# Altium schematic sheet Test.SchDoc
size A4
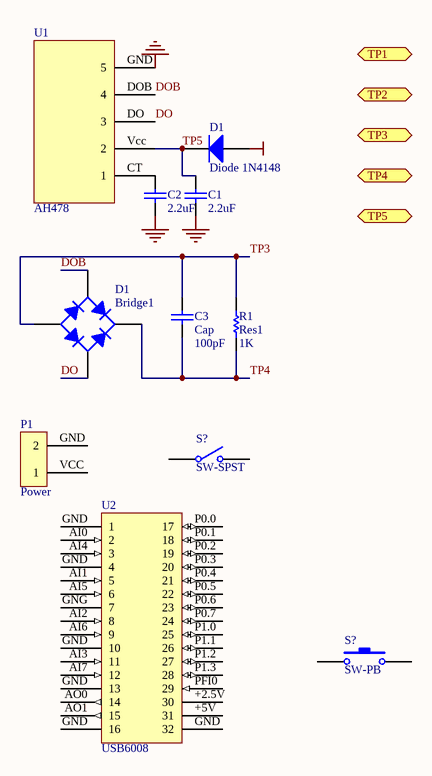
[diagram p0: Test.SchDoc]

## Parts
(Parts that share a designator on the sheet are numbered #1, #2 ... from top to bottom, then left to right.)
C1  value 2.2uF  [CC1310-0504]  (hidden comment: Cap Semi)
C2  value 2.2uF  [CC1310-0504]  (hidden comment: Cap Semi)
C3  Cap  value 100pF  [RAD-0.3]
D1#1  Diode 1N4148  [DIO7.1-3.9x1.9]
D1#2  Bridge1  [E-BIP-P4/D10]
P1  Power
R1  Res1  value 1K  [AXIAL-0.3]
S?#1  SW-SPST  [SPST-2]
S?#2  SW-PB  [SPST-2]
U1  AH478
U2  USB6008

## Ports
TP1, TP2, TP3, TP4, TP5

## Nets
+14V: D1#1.1(A)
GND: C1.1 C2.1 U1.GND(5)
DO: D1#2.4(C) U1.DO(3)
DOB: D1#2.2(C) U1.DOB(4)
TP3: C3.2 D1#2.1(A) R1.2
TP4: C3.1 D1#2.3(K) R1.1
TP5: C1.2 D1#1.2(K) U1.Vcc(2)
NetC2_2: C2.2 U1.CT(1)

Not connected (* = marked no-connect by the designer): P1 GND(2) VCC(1); S?#1 1(COMMON) 2(NO); S?#2 1 2; U2 +2.5V(30) +5V(31) AI0(2) AI1(5) AI2(8) AI3(11) AI4(3) AI5(6) AI6(9) AI7(12) AO0(14) AO1(15) GND(1) GNG(7) P0.0(17) P0.1(18) P0.2(19) P0.3(20) P0.4(21) P0.5(22) P0.6(23) P0.7(24) P1.0(25) P1.1(26) P1.2(27) P1.3(28) PFI0(29)

## Library data of the parts
C1 C2 = Cap Semi: Capacitor (Semiconductor SIM Model); Published: 8-Jun-2000; Revision: July-2002: Re-released for DXP Platform.; Publisher: Altium Limited
C3 = Cap: Capacitor; Published: 8-Jun-2000; Revision: July-2002: Re-released for DXP Platform.; Publisher: Altium Limited
D1#1 = Diode 1N4148: High Conductance Fast Diode; Revision 1: 11-Jul-2000: SIM Model Added.; Revision 2: 17-Jul-2002: Re-released for DXP Platform.; Code - JEDEC: DO-204-AH; Published: 8-Jun-2000; Datasheet: Latest Revision: 1997; Package Reference: DO-35; Publisher: Altium Limited
D1#2 = Bridge1: Full Wave Diode Bridge; Published: 8-Jun-2000; Revision: July-2002: Re-released for DXP Platform.; Publisher: Altium Limited
R1 = Res1: Resistor; Published: 8-Jun-2000; Revision: July-2002: Re-released for DXP Platform.; Publisher: Altium Limited
S?#1 = SW-SPST: Single-Pole, Single-Throw Switch; Published: 24-Mar-1999; Revision: July-2002: Re-released for DXP Platform.; Publisher: Altium Limited
S?#2 = SW-PB: Switch; Published: 24-Mar-1999; Revision: July-2002: Re-released for DXP Platform.; Publisher: Altium Limited